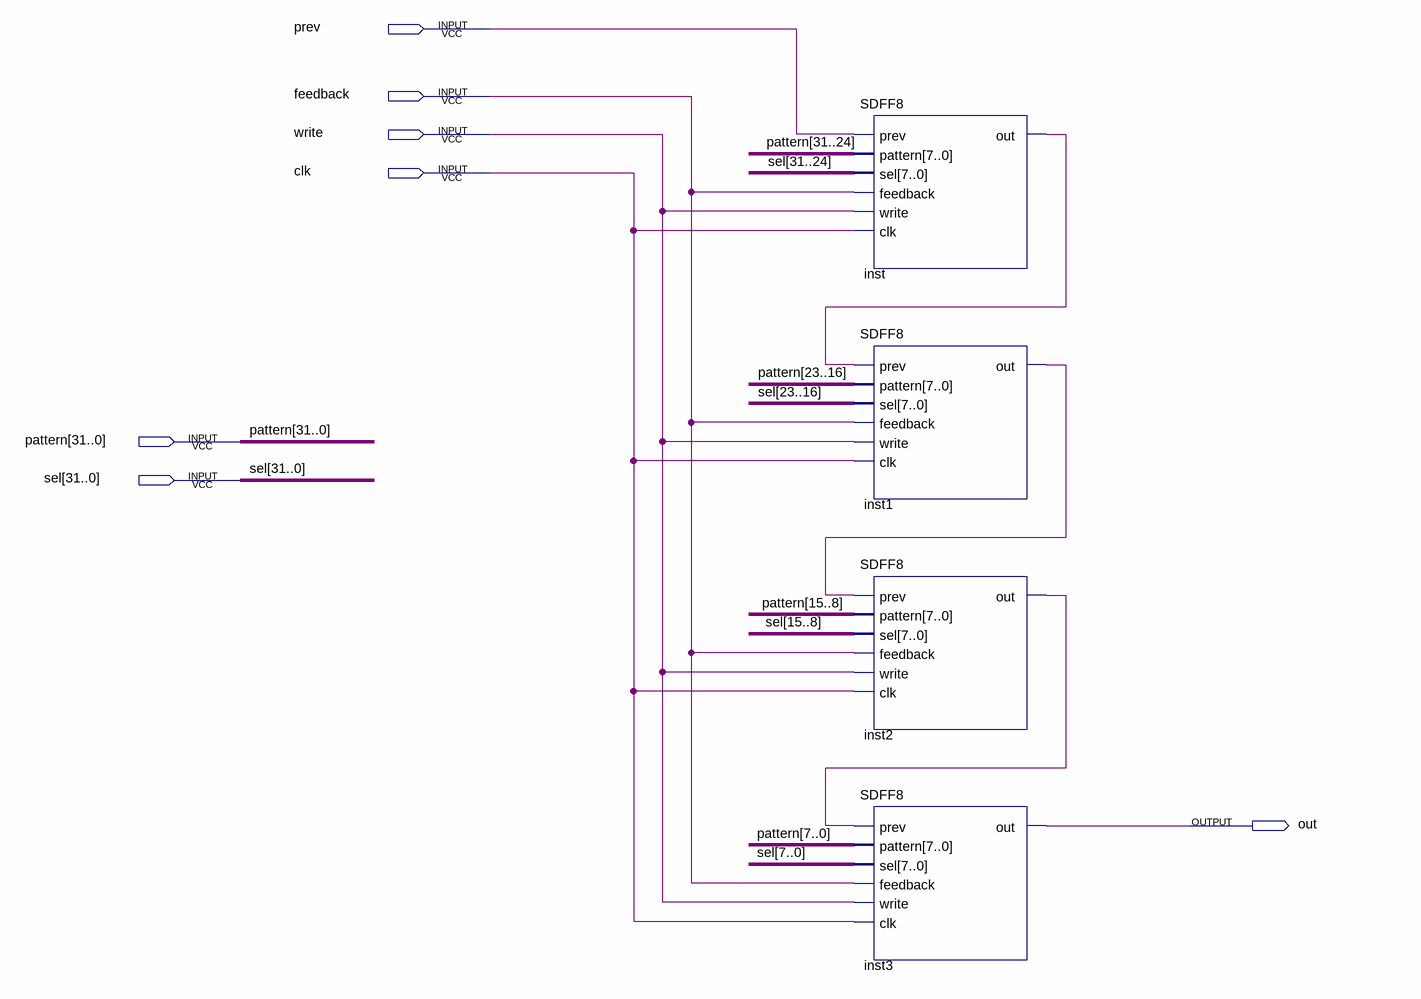
[diagram p0: schematic sheet]
// Quartus schematic SDFF32.bdf as structural Verilog: 4 symbols, 7 pins
module SDFF32 (
  input  prev,
  input  feedback,
  input  write,
  input  clk,
  input  [31:0] pattern,
  input  [31:0] sel,
  output out
);

  wire inst1_out, inst2_out, inst_out;

  SDFF8 inst (
    .prev(prev), .pattern(pattern[31:24]), .sel(sel[31:24]), .feedback(feedback), .write(write), .clk(clk),
    .out(inst_out));
  SDFF8 inst1 (
    .prev(inst_out), .pattern(pattern[23:16]), .sel(sel[23:16]), .feedback(feedback), .write(write),
    .clk(clk), .out(inst1_out));
  SDFF8 inst2 (
    .prev(inst1_out), .pattern(pattern[15:8]), .sel(sel[15:8]), .feedback(feedback), .write(write),
    .clk(clk), .out(inst2_out));
  SDFF8 inst3 (
    .prev(inst2_out), .pattern(pattern[7:0]), .sel(sel[7:0]), .feedback(feedback), .write(write), .clk(clk),
    .out(out));
endmodule
